# EAGLE schematic ARK (EAGLE 9.4.2)
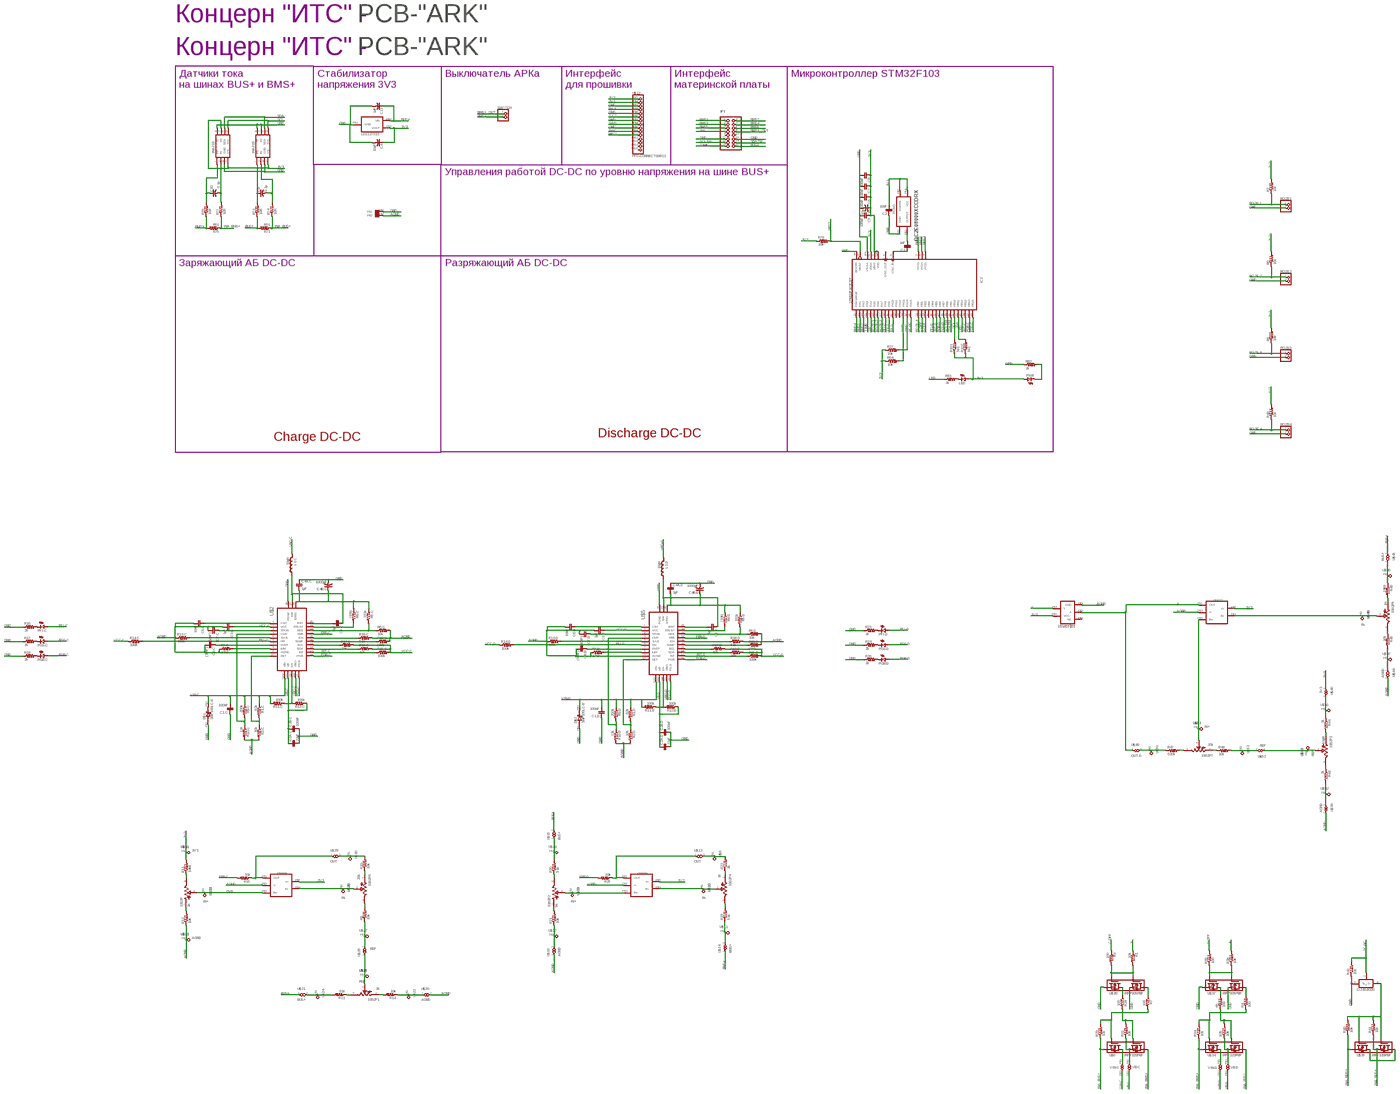
[diagram p0: schematic, sheet 1, overview]
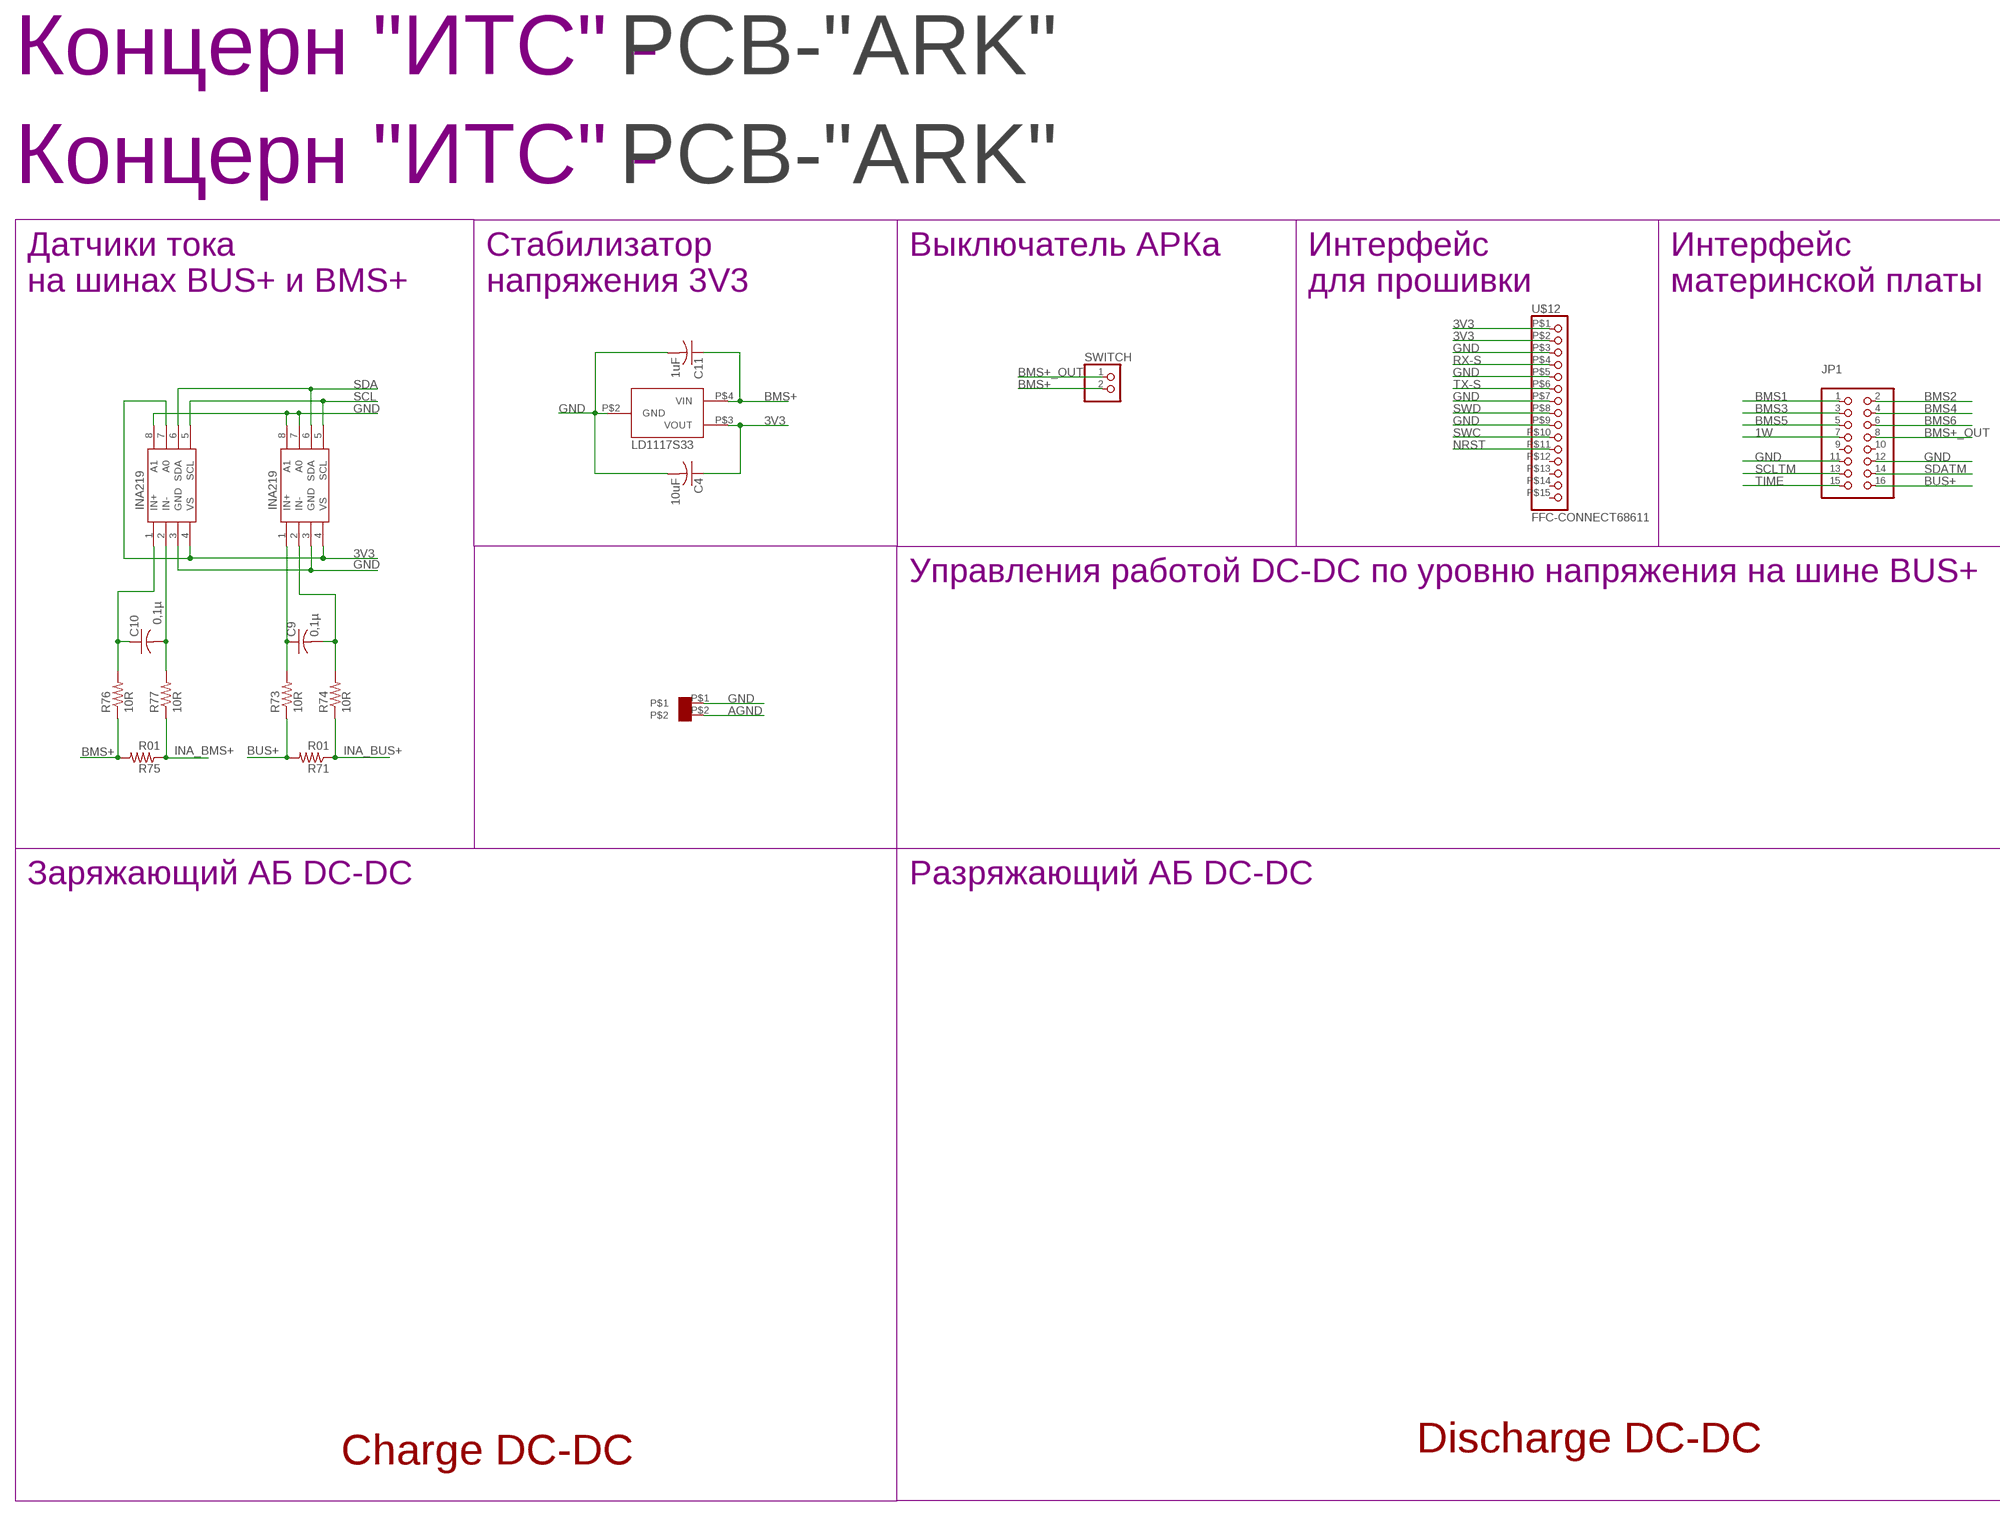
[diagram p1: schematic, sheet 1, part 1 of 4]
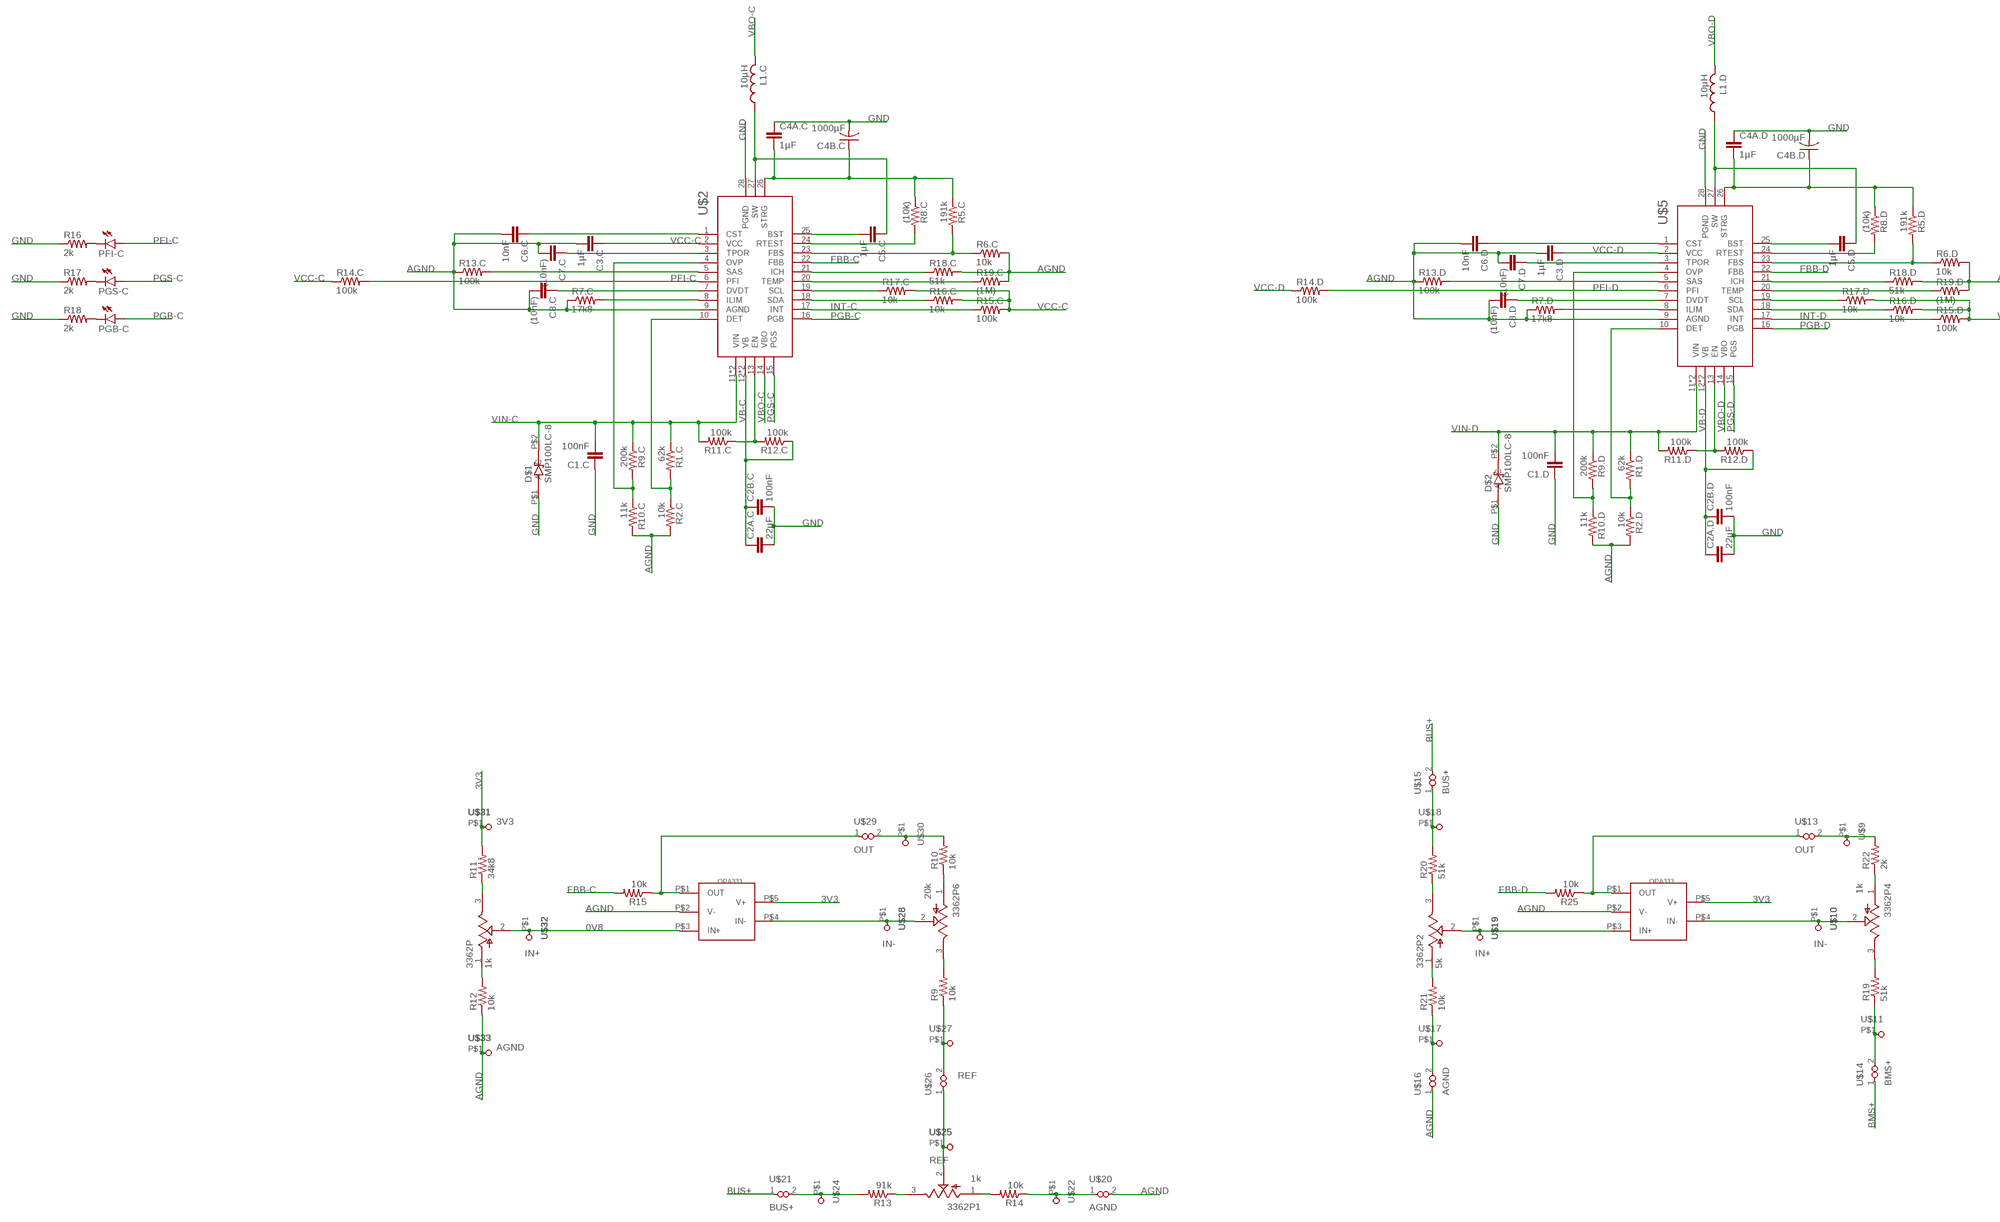
[diagram p2: schematic, sheet 1, part 2 of 4]
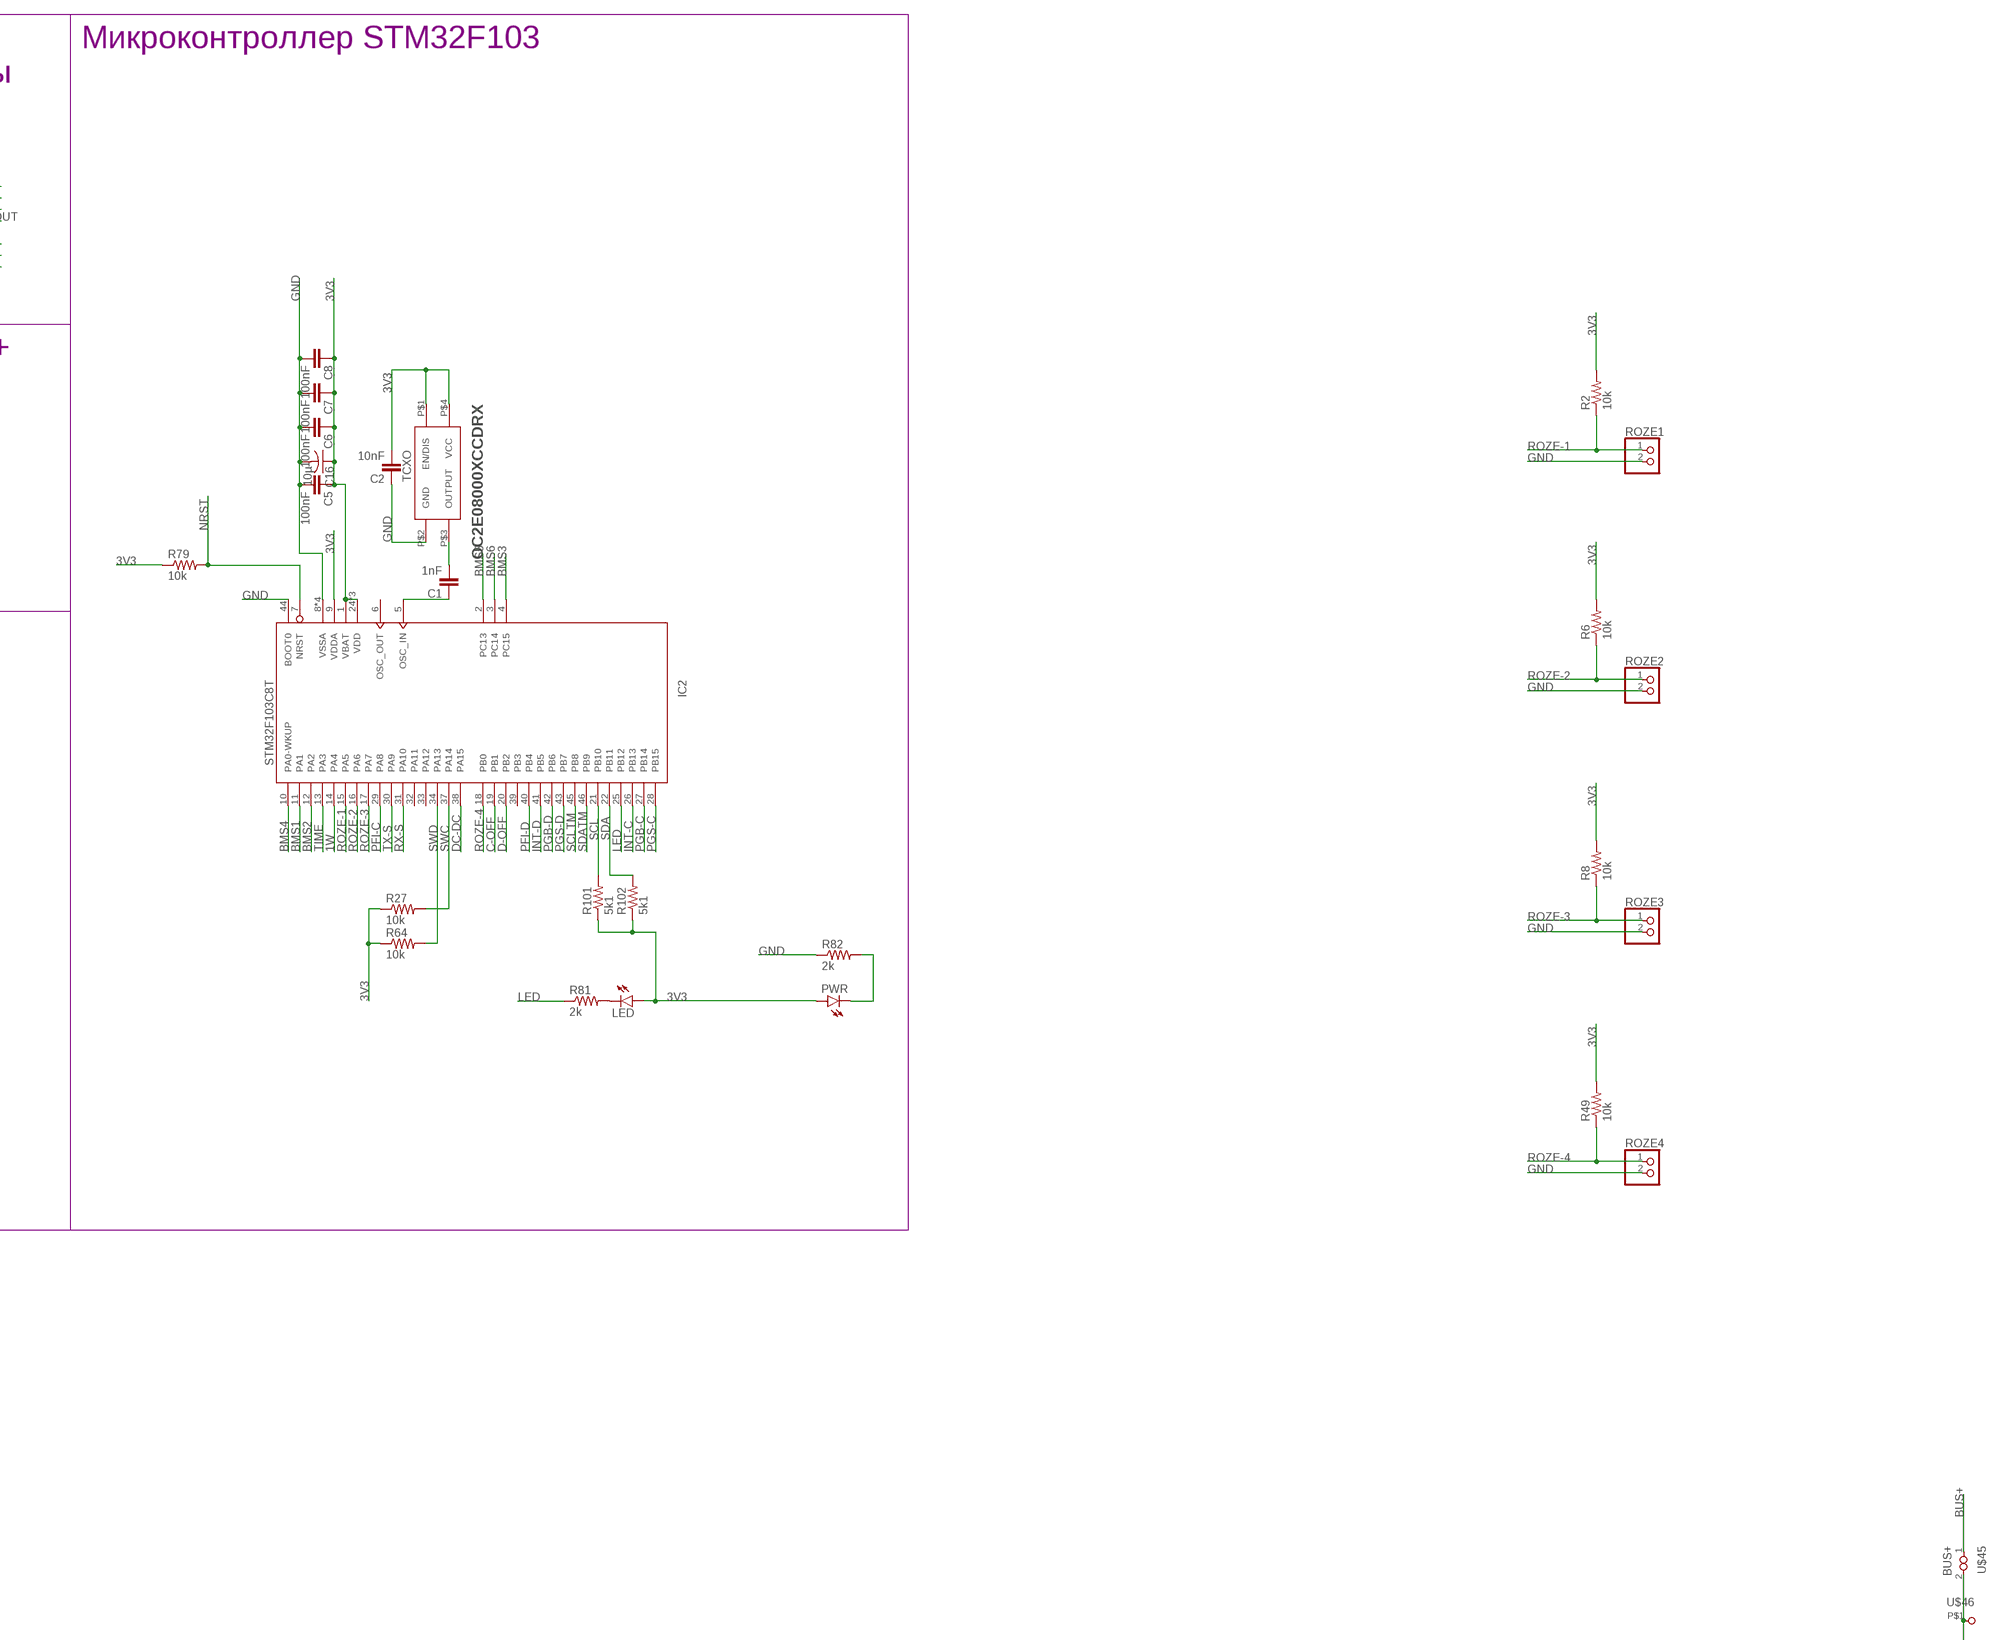
[diagram p3: schematic, sheet 1, part 3 of 4]
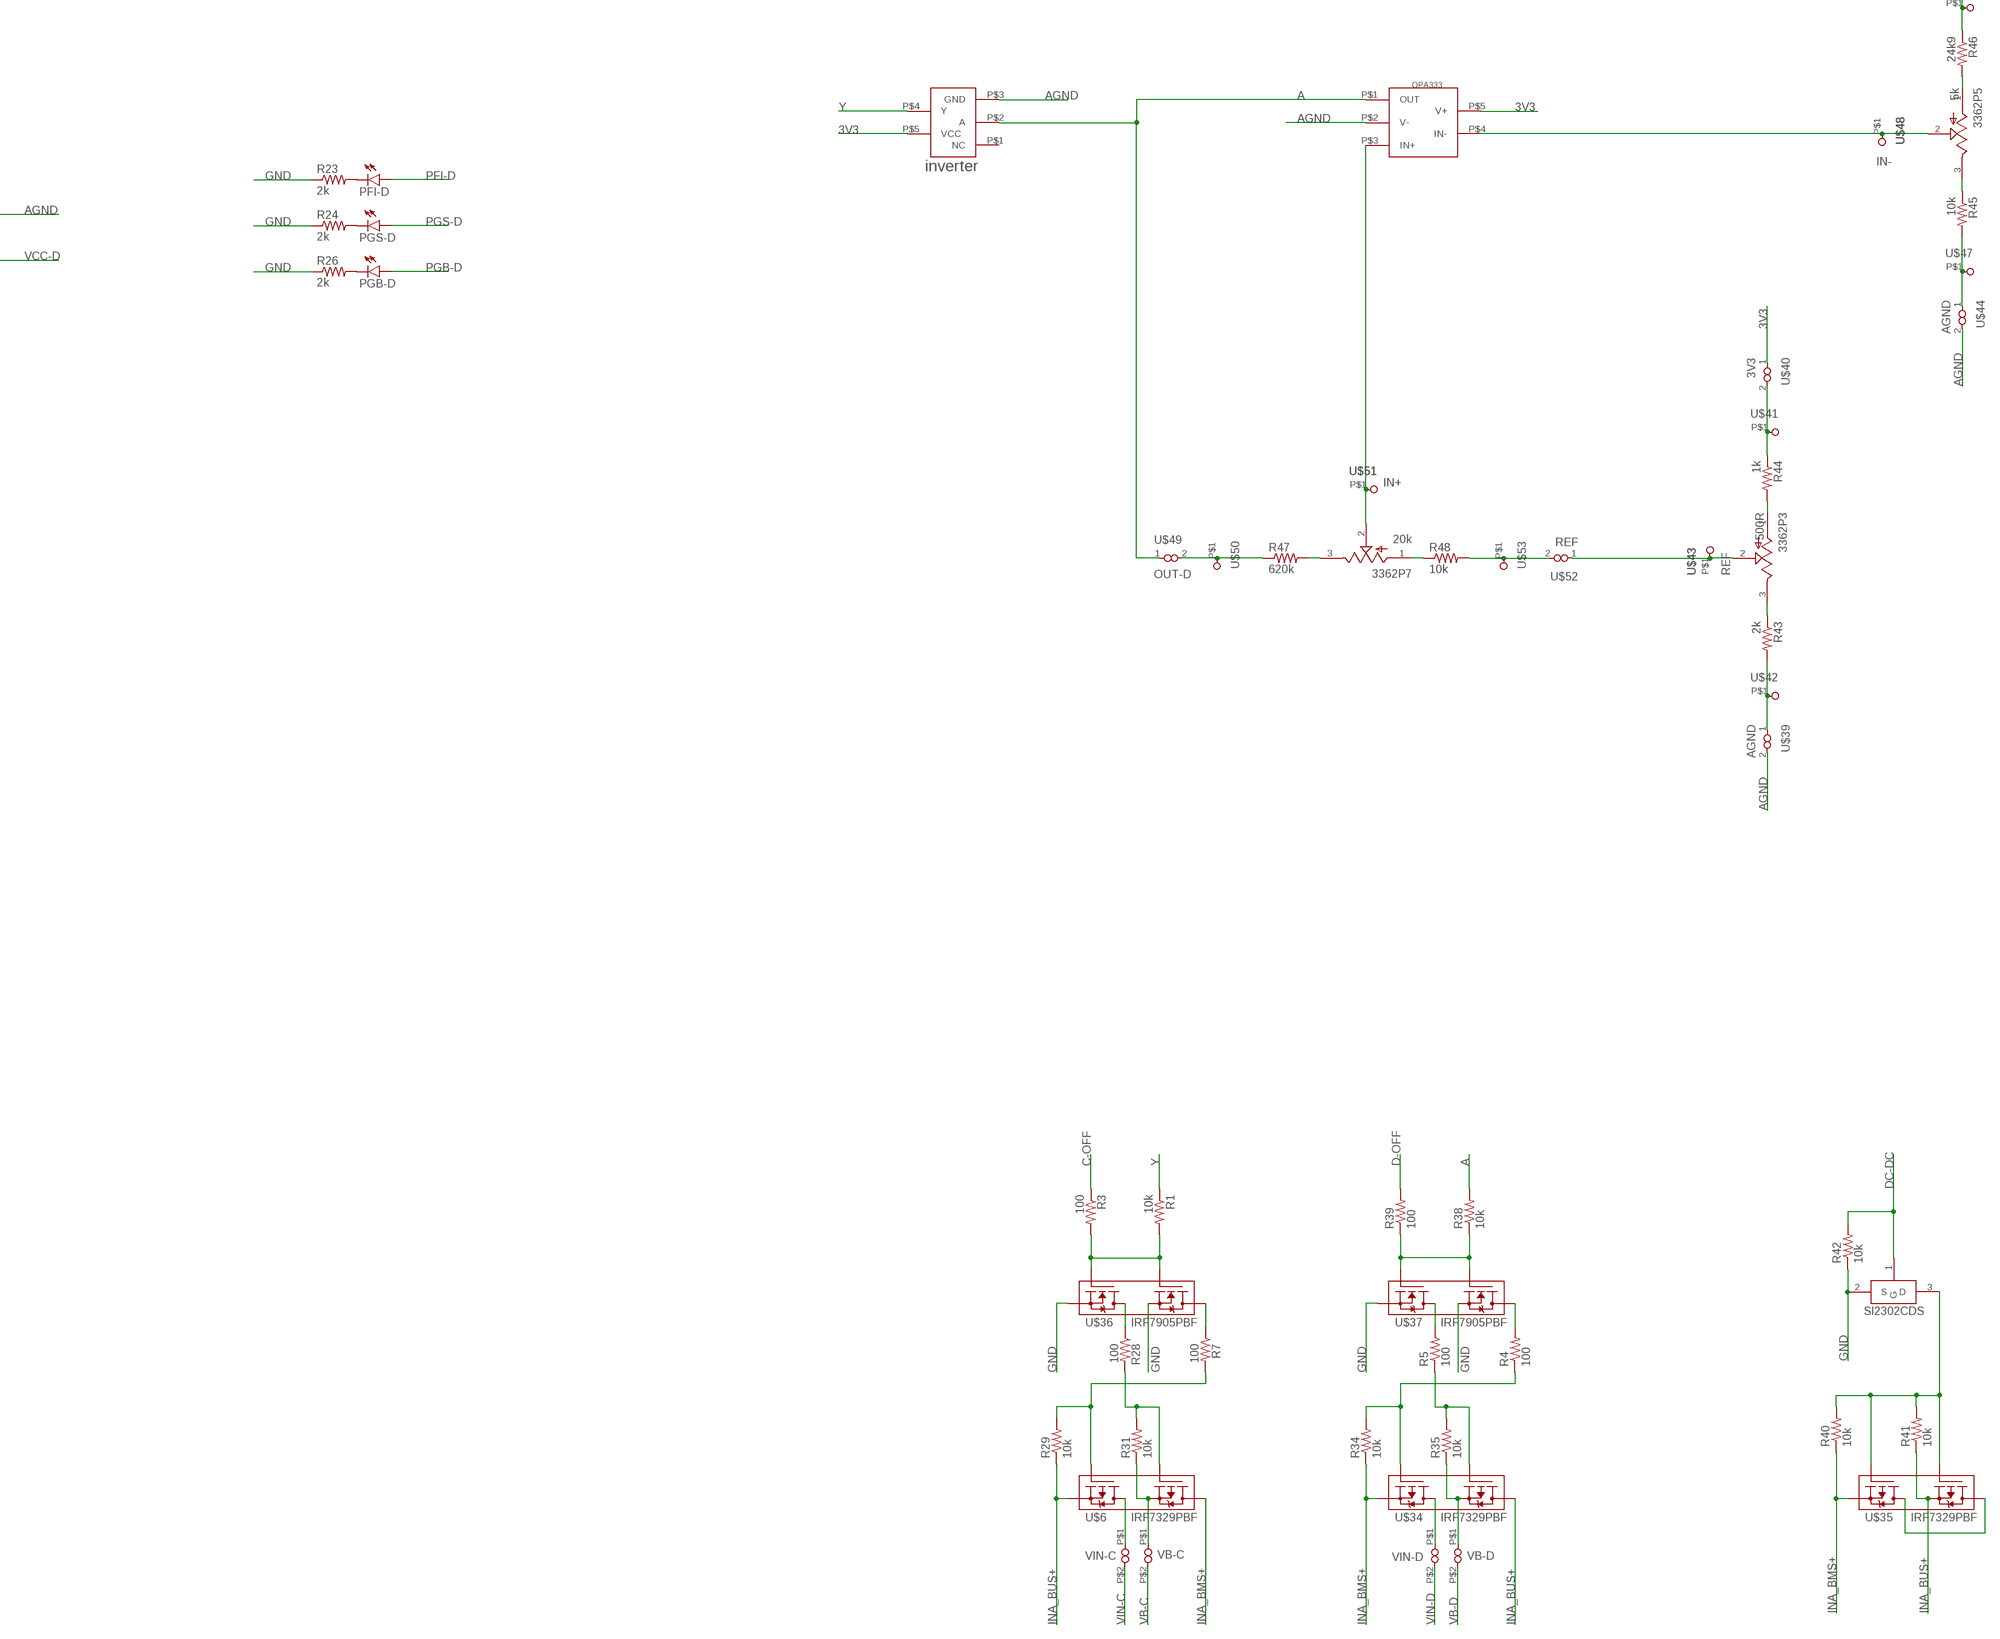
[diagram p4: schematic, sheet 1, part 4 of 4]

## Parts
3362P  1k  3362P-1-502LF  [TRIM_3362P-1-502LF]
3362P1  1k  3362P-1-502LF  [TRIM_3362P-1-502LF]
3362P2  5k  3362P-1-502LF  [TRIM_3362P-1-502LF]
3362P3  500R  3362P-1-502LF  [TRIM_3362P-1-502LF]
3362P4  1k  3362P-1-502LF  [TRIM_3362P-1-502LF]
3362P5  5k  3362P-1-502LF  [TRIM_3362P-1-502LF]
3362P6  20k  3362P-1-502LF  [TRIM_3362P-1-502LF]
3362P7  20k  3362P-1-502LF  [TRIM_3362P-1-502LF]
C1  1nF  C-EUC0603  [C0603]
C1.C  100nF  C-EUC0603  [C0603]
C1.D  100nF  C-EUC0603  [C0603]
C2  10nF  C-EUC0603  [C0603]
C2A.C  22µF  C-EUC1206  [C1206]
C2A.D  22µF  C-EUC1206  [C1206]
C2B.C  100nF  C-EUC0603  [C0603]
C2B.D  100nF  C-EUC0603  [C0603]
C3.C  1µF  C-EUC0603  [C0603]
C3.D  1µF  C-EUC0603  [C0603]
C4  10uF  ECAP1UF  [ECAP-SMD-D4]
C4A.C  1µF  C-EUC1206  [C1206]
C4A.D  1µF  C-EUC1206  [C1206]
C4B.C  1000µF  ECAPECAP1000  [ECAP1000-CMD]
C4B.D  1000µF  ECAPECAP1000  [ECAP1000-CMD]
C5  100nF  C-EUC0603  [C0603]
C5.C  1µF  C-EUC0603  [C0603]
C5.D  1µF  C-EUC0603  [C0603]
C6  100nF  C-EUC0603  [C0603]
C6.C  10nF  C-EUC0603  [C0603]
C6.D  10nF  C-EUC0603  [C0603]
C7  100nF  C-EUC0603  [C0603]
C7.C  (10nF)  C-EUC0603  [C0603]
C7.D  (10nF)  C-EUC0603  [C0603]
C8  100nF  C-EUC0603  [C0603]
C8.C  (10nF)  C-EUC0603  [C0603]
C8.D  (10nF)  C-EUC0603  [C0603]
C9  0,1µ  C-USC0603  [C0603]
C10  0,1µ  C-USC0603  [C0603]
C11  1uF  ECAP1UF  [ECAP-SMD-D4]
C16  10µ  C-USC1206  [C1206]
D$1  SMP100LC-8  [SMB]
D$2  SMP100LC-8  [SMB]
IC2  STM32F103C8T  [LQFP48]
INA219#1  INA219AID  [SOT23-8]
INA219#2  INA219AID  [SOT23-8]
INVERT1  INVERTER.  [SC70]
JP1  PINHD-2X8  [2X08]
L1.C  10µH  L_10MKH  [L_12X12]
L1.D  10µH  L_10MKH  [L_12X12]
LD1117S33  LD1117S33  [SOT223]
LED  LEDCHIPLED_0603  [CHIPLED_0603]
OPA1  OPA333  [SOT23-5]
OPA2  OPA333  [SOT23-5]
OPA3  OPA333  [SOT23-5]
PFI-C  LEDCHIPLED_0603  [CHIPLED_0603]
PFI-D  LEDCHIPLED_0603  [CHIPLED_0603]
PGB-C  LEDCHIPLED_0603  [CHIPLED_0603]
PGB-D  LEDCHIPLED_0603  [CHIPLED_0603]
PGS-C  LEDCHIPLED_0603  [CHIPLED_0603]
PGS-D  LEDCHIPLED_0603  [CHIPLED_0603]
PWR  LEDCHIPLED_0603  [CHIPLED_0603]
R1  10k  R-US_R0603  [R0603]
R1.C  62k  R-US_R0603  [R0603]
R1.D  62k  R-US_R0603  [R0603]
R2  10k  R-US_R0603  [R0603]
R2.C  10k  R-US_R0603  [R0603]
R2.D  10k  R-US_R0603  [R0603]
R3  100  R-US_R0603  [R0603]
R4  100  R-US_R0603  [R0603]
R5  100  R-US_R0603  [R0603]
R5.C  191k  R-US_R0603  [R0603]
R5.D  191k  R-US_R0603  [R0603]
R6  10k  R-US_R0603  [R0603]
R6.C  10k  R-US_R0603  [R0603]
R6.D  10k  R-US_R0603  [R0603]
R7  100  R-US_R0603  [R0603]
R7.C  17k8  R-US_R0603  [R0603]
R7.D  17k8  R-US_R0603  [R0603]
R8  10k  R-US_R0603  [R0603]
R8.C  (10k)  R-US_R0603  [R0603]
R8.D  (10k)  R-US_R0603  [R0603]
R9  10k  R-US_R0603  [R0603]
R9.C  200k  R-US_R0603  [R0603]
R9.D  200k  R-US_R0603  [R0603]
R10  10k  R-US_R0603  [R0603]
R10.C  11k  R-US_R0603  [R0603]
R10.D  11k  R-US_R0603  [R0603]
R11  34k8  R-US_R0603  [R0603]
R11.C  100k  R-US_R0603  [R0603]
R11.D  100k  R-US_R0603  [R0603]
R12  10k  R-US_R0603  [R0603]
R12.C  100k  R-US_R0603  [R0603]
R12.D  100k  R-US_R0603  [R0603]
R13  91k  R-US_R0603  [R0603]
R13.C  100k  R-US_R0603  [R0603]
R13.D  100k  R-US_R0603  [R0603]
R14  10k  R-US_R0603  [R0603]
R14.C  100k  R-US_R0603  [R0603]
R14.D  100k  R-US_R0603  [R0603]
R15  10k  R-US_R0603  [R0603]
R15.C  100k  R-US_R0603  [R0603]
R15.D  100k  R-US_R0603  [R0603]
R16  2k  R-US_R0603  [R0603]
R16.C  10k  R-US_R0603  [R0603]
R16.D  10k  R-US_R0603  [R0603]
R17  2k  R-US_R0603  [R0603]
R17.C  10k  R-US_R0603  [R0603]
R17.D  10k  R-US_R0603  [R0603]
R18  2k  R-US_R0603  [R0603]
R18.C  51k  R-US_R0603  [R0603]
R18.D  51k  R-US_R0603  [R0603]
R19  51k  R-US_R0603  [R0603]
R19.C  (1M)  R-US_R0603  [R0603]
R19.D  (1M)  R-US_R0603  [R0603]
R20  51k  R-US_R0603  [R0603]
R21  10k  R-US_R0603  [R0603]
R22  2k  R-US_R0603  [R0603]
R23  2k  R-US_R0603  [R0603]
R24  2k  R-US_R0603  [R0603]
R25  10k  R-US_R0603  [R0603]
R26  2k  R-US_R0603  [R0603]
R27  10k  R-US_R0603  [R0603]
R28  100  R-US_R0603  [R0603]
R29  10k  R-US_R0603  [R0603]
R31  10k  R-US_R0603  [R0603]
R34  10k  R-US_R0603  [R0603]
R35  10k  R-US_R0603  [R0603]
R38  10k  R-US_R0603  [R0603]
R39  100  R-US_R0603  [R0603]
R40  10k  R-US_R0603  [R0603]
R41  10k  R-US_R0603  [R0603]
R42  10k  R-US_R0603  [R0603]
R43  2k  R-US_R0603  [R0603]
R44  1k  R-US_R0603  [R0603]
R45  10k  R-US_R0603  [R0603]
R46  24k9  R-US_R0603  [R0603]
R47  620k  R-US_R0603  [R0603]
R48  10k  R-US_R0603  [R0603]
R49  10k  R-US_R0603  [R0603]
R64  10k  R-US_R0603  [R0603]
R71  R01  R-US_R2512  [R2512]
R73  10R  R-US_R0603  [R0603]
R74  10R  R-US_R0603  [R0603]
R75  R01  R-US_R2512  [R2512]
R76  10R  R-US_R0603  [R0603]
R77  10R  R-US_R0603  [R0603]
R79  10k  R-US_R0603  [R0603]
R81  2k  R-US_R0603  [R0603]
R82  2k  R-US_R0603  [R0603]
R101  5k1  R-US_R0603  [R0603]
R102  5k1  R-US_R0603  [R0603]
ROZE1  PINHD-1X2  [1X02]
ROZE2  PINHD-1X2  [1X02]
ROZE3  PINHD-1X2  [1X02]
ROZE4  PINHD-1X2  [1X02]
SWITCH  PINHD-1X2  [1X02]
TCXO  OC2E08000XCCDRX  [OC2E08000XCCDRX]
U$1  VIN-C  VIAS-CONNECTW1.4MM  [SOLDERING-PAD-4A]
U$2  MP5515  [QFN-30]
U$3  PCB-"ARK"  ITS-LOGOPCB-""  [ITS-LOGO]
U$4  PCB-"ARK"  ITS-LOGOPCB-""  [ITS-LOGO]
U$5  MP5515  [QFN-30]
U$6  IRF7329PBF  [SO8]
U$7  GNDS-CONNECTOR  [GNDS-CONNECTOR]
U$9  VIAS  [VIAS]
U$10  IN-  VIAS  [VIAS]
U$11  VIAS  [VIAS]
U$12  FFC-CONNECT68611  [68611]
U$13  OUT  VIAS-CONNECT  [VIAS-CONNECT]
U$14  BMS+  VIAS-CONNECT  [VIAS-CONNECT]
U$15  BUS+  VIAS-CONNECT  [VIAS-CONNECT]
U$16  AGND  VIAS-CONNECT  [VIAS-CONNECT]
U$17  VIAS  [VIAS]
U$18  VIAS  [VIAS]
U$19  IN+  VIAS  [VIAS]
U$20  AGND  VIAS-CONNECT  [VIAS-CONNECT]
U$21  BUS+  VIAS-CONNECT  [VIAS-CONNECT]
U$22  VIAS  [VIAS]
U$23  VB-C  VIAS-CONNECTW1.4MM  [SOLDERING-PAD-4A]
U$24  VIAS  [VIAS]
U$25  REF  VIAS  [VIAS]
U$26  REF  VIAS-CONNECT  [VIAS-CONNECT]
U$27  VIAS  [VIAS]
U$28  IN-  VIAS  [VIAS]
U$29  OUT  VIAS-CONNECT  [VIAS-CONNECT]
U$30  VIAS  [VIAS]
U$31  3V3  VIAS  [VIAS]
U$32  IN+  VIAS  [VIAS]
U$33  AGND  VIAS  [VIAS]
U$34  IRF7329PBF  [SO8]
U$35  IRF7329PBF  [SO8]
U$36  IRF7905PBF  [SO8]
U$37  IRF7905PBF  [SO8]
U$38  SI2302CDS  [SOT23-3]
U$39  AGND  VIAS-CONNECT  [VIAS-CONNECT]
U$40  3V3  VIAS-CONNECT  [VIAS-CONNECT]
U$41  VIAS  [VIAS]
U$42  VIAS  [VIAS]
U$43  REF  VIAS  [VIAS]
U$44  AGND  VIAS-CONNECT  [VIAS-CONNECT]
U$45  BUS+  VIAS-CONNECT  [VIAS-CONNECT]
U$46  VIAS  [VIAS]
U$47  VIAS  [VIAS]
U$48  IN-  VIAS  [VIAS]
U$49  OUT-D  VIAS-CONNECT  [VIAS-CONNECT]
U$50  VIAS  [VIAS]
U$51  IN+  VIAS  [VIAS]
U$52  REF  VIAS-CONNECT  [VIAS-CONNECT]
U$53  VIAS  [VIAS]
U$54  VIN-D  VIAS-CONNECTW1.4MM  [SOLDERING-PAD-4A]
U$55  VB-D  VIAS-CONNECTW1.4MM  [SOLDERING-PAD-4A]

## Nets
0V8: 3362P.2(WIPER) OPA2.P$3(IN+) U$32.P$1
1W: IC2.14(PA4) JP1.7
3V3: C2.2 C4.P+ C5.1 C6.1 C7.1 C8.1 C16.1 IC2.1(VBAT) IC2.9(VDDA) IC2.24(VDD) IC2.36(VDD) IC2.48(VDD) INA219#1.4(VS) INA219#2.4(VS) INA219#2.7(A0) INVERT1.P$5(VCC) LD1117S33.P$3(VOUT) LED.A OPA1.P$5(V+) OPA2.P$5(V+) OPA3.P$5(V+) PWR.A R2.2 R6.2 R8.2 R11.2 R27.1 R49.2 R64.1 R79.1 R101.1 R102.1 TCXO.P$1(EN/DIS) TCXO.P$4(VCC) U$12.P$1 U$12.P$2 U$31.P$1 U$40.1
A: INVERT1.P$2(A) OPA1.P$1(OUT) R38.2 U$49.1
AGND: C3.C.2 C3.D.2 C6.C.2 C6.D.2 C7.C.2 C7.D.2 C8.C.2 C8.D.2 INVERT1.P$3(GND) OPA1.P$2(V-) OPA2.P$2(V-) OPA3.P$2(V-) R2.C.2 R2.D.2 R6.C.2 R6.D.2 R7.C.1 R7.D.1 R10.C.2 R10.D.2 R12.1 R13.C.1 R13.D.1 R18.C.2 R18.D.2 R19.C.2 R19.D.2 U$2.9(AGND) U$5.9(AGND) U$7.P$2 U$16.1 U$20.2 U$33.P$1 U$39.2 U$44.2
BMS1: IC2.11(PA1) JP1.1
BMS2: IC2.12(PA2) JP1.2
BMS3: IC2.4(PC15) JP1.3
BMS4: IC2.10(PA0-WKUP) JP1.4
BMS5: IC2.2(PC13) JP1.5
BMS6: IC2.3(PC14) JP1.6
BMS+: C11.P+ LD1117S33.P$4(VIN) R75.2 R76.1 SWITCH.2 U$14.1
BMS+_OUT: JP1.8 SWITCH.1
BUS+: JP1.16 R71.2 R73.1 U$15.2 U$21.1 U$45.1
C-OFF: IC2.19(PB1) R3.1
D-OFF: IC2.20(PB2) R39.2
DC-DC: IC2.38(PA15) R42.2 U$38.1(G)
FBB-C: R15.2 U$2.22(FBB)
FBB-D: R25.2 U$5.22(FBB)
GND: C1.C.1 C1.D.1 C2.1 C2A.C.2 C2A.D.2 C2B.C.2 C2B.D.2 C4.P- C4A.C.1 C4A.D.1 C4B.C.P$2 C4B.D.P$2 C5.2 C6.2 C7.2 C8.2 C11.P- C16.2 D$1.P$1(A) D$2.P$1(A) IC2.8(VSSA) IC2.23(VSSA) IC2.35(VSSA) IC2.44(BOOT0) IC2.47(VSSA) INA219#1.3(GND) INA219#1.7(A0) INA219#1.8(A1) INA219#2.3(GND) INA219#2.8(A1) JP1.11 JP1.12 LD1117S33.P$2(GND) R16.1 R17.1 R18.1 R23.1 R24.1 R26.1 R42.1 R82.1 ROZE1.2 ROZE2.2 ROZE3.2 ROZE4.2 TCXO.P$2(GND) U$2.28(PGND) U$5.28(PGND) U$7.P$1 U$12.P$3 U$12.P$5 U$12.P$7 U$12.P$9 U$36.1(S2) U$36.3(S1) U$37.1(S2) U$37.3(S1) U$38.2(S)
INA_BMS+: R34.1 R40.1 R75.1 R77.1 U$6.7(D1) U$6.8(D1) U$34.3(S2) U$35.3(S2)
INA_BUS+: R29.1 R41.1 R71.1 R74.1 U$6.3(S2) U$34.7(D1) U$34.8(D1) U$35.1(S1)
INT-C: IC2.26(PB13) R15.C.1 U$2.17(INT)
INT-D: IC2.41(PB5) R15.D.1 U$5.17(INT)
LED: IC2.25(PB12) R81.1
N$1: C1.1 IC2.5(OSC_IN)
N$2: U$1.P$1 U$6.5(D2) U$6.6(D2)
N$3: R31.1 U$6.1(S1) U$23.P$1
N$4: C1.2 TCXO.P$3(OUTPUT)
N$5: R4.1 R34.2 U$34.4(G2)
N$6: OPA3.P$1(OUT) R25.1 U$13.1
N$7: R11.C.1 R12.C.2 U$2.13(EN)
N$8: R7.C.2 U$2.8(ILIM)
N$9: C7.C.1 U$2.3(TPOR)
N$10: R1.C.2 R2.C.1 U$2.10(DET)
N$11: R9.C.2 R10.C.1 U$2.4(OVP)
N$12: C8.C.1 U$2.7(DVDT)
N$13: R18.C.1 U$2.21(ICH)
N$14: C9.2 INA219#1.2(IN-) R74.2
N$15: R19.C.1 U$2.20(TEMP)
N$16: R13.C.2 U$2.5(SAS)
N$17: LED.C R81.2
N$18: C6.C.1 U$2.1(CST)
N$19: C4A.C.2 C4B.C.P$1 R5.C.1 R8.C.1 U$2.26(STRG)
N$20: C5.C.2 U$2.25(BST)
N$21: C5.C.1 L1.C.P$1 U$2.27(SW)
N$22: R5.C.2 R6.C.1 U$2.23(FBS)
N$23: R8.C.2 U$2.24(RTEST)
N$24: 3362P4.1(CCW) R22.1
N$25: R7.2 R29.2 U$6.4(G2)
N$26: R17.C.1 U$2.19(SCL)
N$27: R16.C.1 U$2.18(SDA)
N$28: R5.1 R35.2 U$34.2(G1)
N$29: 3362P2.2(WIPER) OPA3.P$3(IN+) U$19.P$1
N$30: R11.D.1 R12.D.2 U$5.13(EN)
N$31: R1.D.2 R2.D.1 U$5.10(DET)
N$32: R9.D.2 R10.D.1 U$5.4(OVP)
N$33: R7.D.2 U$5.8(ILIM)
N$34: C7.D.1 U$5.3(TPOR)
N$35: C8.D.1 U$5.7(DVDT)
N$36: R18.D.1 U$5.21(ICH)
N$37: R19.D.1 U$5.20(TEMP)
N$38: R13.D.2 U$5.5(SAS)
N$39: C6.D.1 U$5.1(CST)
N$40: C5.D.2 U$5.25(BST)
N$41: C5.D.1 L1.D.P$1 U$5.27(SW)
N$42: R5.D.2 R6.D.1 U$5.23(FBS)
N$43: R8.D.2 U$5.24(RTEST)
N$44: C4A.D.2 C4B.D.P$1 R5.D.1 R8.D.1 U$5.26(STRG)
N$46: U$35.5(D2) U$35.6(D2) U$35.7(D1) U$35.8(D1)
N$47: R17.D.1 U$5.19(SCL)
N$48: R1.2 R3.2 U$36.2(G2) U$36.4(G1)
N$49: R16.D.1 U$5.18(SDA)
N$50: U$34.5(D2) U$34.6(D2) U$54.P$1
N$51: R38.1 R39.1 U$37.2(G2) U$37.4(G1)
N$52: OPA2.P$1(OUT) R15.1 U$29.1
N$53: 3362P6.2(WIPER) OPA2.P$4(IN-) U$28.P$1
N$54: 3362P6.3(CW) R9.2
N$55: 3362P6.1(CCW) R10.1
N$56: PFI-C.C R16.2
N$57: 3362P.3(CW) R11.1
N$58: 3362P.1(CCW) R12.2
N$59: 3362P1.3(CW) R13.1
N$60: 3362P1.1(CCW) R14.2
N$61: 3362P1.2(WIPER) U$25.P$1 U$26.1
N$62: 3362P2.3(CW) R20.1
N$63: PGS-C.C R17.2
N$64: 3362P2.1(CCW) R21.2
N$65: PGB-C.C R18.2
N$66: 3362P4.2(WIPER) OPA3.P$4(IN-) U$10.P$1
N$67: 3362P4.3(CW) R19.2
N$68: PFI-D.C R23.2
N$69: PGS-D.C R24.2
N$70: PGB-D.C R26.2
N$71: R22.2 U$9.P$1 U$13.2
N$72: R19.1 U$11.P$1 U$14.2
N$73: R20.2 U$15.1 U$18.P$1
N$74: R21.1 U$16.2 U$17.P$1
N$75: R13.2 U$21.2 U$24.P$1
N$76: R14.1 U$20.1 U$22.P$1
N$77: R35.1 U$34.1(S1) U$55.P$1
N$78: R5.2 U$37.7(D2) U$37.8(D2)
N$79: R28.1 U$36.7(D2) U$36.8(D2)
N$80: R4.2 U$37.5(D1) U$37.6(D1)
N$81: R7.1 U$36.5(D1) U$36.6(D1)
N$83: R9.1 U$26.2 U$27.P$1
N$86: R10.2 U$29.2 U$30.P$1
N$88: R28.2 R31.2 U$6.2(G1)
N$90: 3362P3.3(CW) R43.1
N$93: 3362P3.1(CCW) R44.2
N$94: 3362P3.2(WIPER) U$43.P$1 U$52.1
N$95: R40.2 R41.2 U$35.2(G1) U$35.4(G2) U$38.3(D)
N$96: R43.2 U$39.1 U$42.P$1
N$97: R44.1 U$40.2 U$41.P$1
N$98: 3362P5.3(CW) R45.1
N$99: 3362P5.1(CCW) R46.2
N$100: 3362P5.2(WIPER) OPA1.P$4(IN-) U$48.P$1
N$101: R45.2 U$44.1 U$47.P$1
N$102: R46.1 U$45.2 U$46.P$1
N$104: 3362P7.1(CCW) R48.1
N$105: 3362P7.2(WIPER) OPA1.P$3(IN+) U$51.P$1
N$106: 3362P7.3(CW) R47.2
N$108: R47.1 U$49.2 U$50.P$1
N$109: R48.2 U$52.2 U$53.P$1
N$147: C9.1 INA219#1.1(IN+) R73.2
N$150: C10.1 INA219#2.1(IN+) R76.2
N$151: C10.2 INA219#2.2(IN-) R77.2
N$159: PWR.C R82.2
NRST: IC2.7(NRST) R79.2 U$12.P$11
PFI-C: IC2.29(PA8) PFI-C.A R14.C.2 U$2.6(PFI)
PFI-D: IC2.40(PB4) PFI-D.A R14.D.2 U$5.6(PFI)
PGB-C: IC2.27(PB14) PGB-C.A U$2.16(PGB)
PGB-D: IC2.42(PB6) PGB-D.A U$5.16(PGB)
PGS-C: IC2.28(PB15) PGS-C.A U$2.15(PGS)
PGS-D: IC2.43(PB7) PGS-D.A U$5.15(PGS)
ROZE-1: IC2.15(PA5) R2.1 ROZE1.1
ROZE-2: IC2.16(PA6) R6.1 ROZE2.1
ROZE-3: IC2.17(PA7) R8.1 ROZE3.1
ROZE-4: IC2.18(PB0) R49.1 ROZE4.1
RX-S: IC2.31(PA10) U$12.P$4
SCL: IC2.21(PB10) INA219#1.5(SCL) INA219#2.5(SCL) R101.2
SCLTM: IC2.45(PB8) JP1.13
SDA: IC2.22(PB11) INA219#1.6(SDA) INA219#2.6(SDA) R102.2
SDATM: IC2.46(PB9) JP1.14
SWC: IC2.37(PA14) R27.2 U$12.P$10
SWD: IC2.34(PA13) R64.2 U$12.P$8
TIME: IC2.13(PA3) JP1.15
TX-S: IC2.30(PA9) U$12.P$6
VB-C: C2A.C.1 C2B.C.1 R12.C.1 U$2.12(VB) U$2.29(VB) U$23.P$2
VB-D: C2A.D.1 C2B.D.1 R12.D.1 U$5.12(VB) U$5.29(VB) U$55.P$2
VBO-C: L1.C.P$2 U$2.14(VBO)
VBO-D: L1.D.P$2 U$5.14(VBO)
VCC-C: C3.C.1 R14.C.1 R15.C.2 R16.C.2 R17.C.2 U$2.2(VCC)
VCC-D: C3.D.1 R14.D.1 R15.D.2 R16.D.2 R17.D.2 U$5.2(VCC)
VIN-C: C1.C.2 D$1.P$2(C) R1.C.1 R9.C.1 R11.C.2 U$1.P$2 U$2.11(VIN) U$2.30(VIN)
VIN-D: C1.D.2 D$2.P$2(C) R1.D.1 R9.D.1 R11.D.2 U$5.11(VIN) U$5.30(VIN) U$54.P$2
Y: INVERT1.P$4(Y) R1.1
Unconnected: IC2.6(OSC_OUT) IC2.32(PA11) IC2.33(PA12) IC2.39(PB3) INVERT1.P$1(NC) JP1.9 JP1.10 U$12.P$12 U$12.P$13 U$12.P$14 U$12.P$15

## Notes on the sheet
- Датчики тока
  на шинах BUS+ и BMS+
- Стабилизатор
  напряжения 3V3
- Выключатель АРКа
- Интерфейс
  для прошивки
- Интерфейс
  материнской платы
- Микроконтроллер STM32F103
- Управления работой DC-DC по уровню напряжения на шине BUS+
- Заряжающий АБ DC-DC | Разряжающий АБ DC-DC
- Charge DC-DC | Discharge DC-DC

## Library data of the parts
3362P 3362P1-3362P7 = CanCubeSat:3362P-1-502LF: Res Cermet Trimmer 50K Ohm 10% 1/2W 1(Elec)/1(Mech)Turn 2.77mm (6.6 X 6.99 X 4.7mm) Pin Thru-Hole Tube Check prices <https://pricing.snapeda.com/parts/3362P-1-502LF/Bourns/view-part?ref=eda>; AVAILABILITY: Good; DESCRIPTION: 5 kOhms 0.5W, 1/2W PC Pins Through Hole Trimmer Potentiometer Cermet 1 Turn Top Adjustment; MF: Bourns; MP: 3362P-1-502LF; PACKAGE: 3362P-1 Bourns Inc.; PRICE: None; PURCHASE-URL: https://pricing.snapeda.com/search/part/3362P-1-502LF/?ref=eda
C1 C1.C C1.D C2 C2A.C C2A.D C2B.C C2B.D C3.C C3.D C4A.C C4A.D C5 C5.C C5.D C6 C6.C C6.D C7 C7.C C7.D C8 C8.C C8.D = rcl:C-EU: CAPACITOR, European symbol; SPICEPREFIX: C
C4 C4B.C C4B.D C11 = CanCubeSat:ECAP
C9 C10 C16 = rcl:C-US: CAPACITOR, American symbol; SPICEPREFIX: C
D$1 D$2 = CanCubeSat:SMP100LC-8
IC2 = CanCubeSat:STM32F103C*T: ARM 32-bit Cortex™-M3 CPU 72 MHz maximum frequency 16 to 128 Kbytes of Flash memory 6 to 20 kbytes of SRAM 37 GPIOs 2.0 to 3.6 V application supply
INA219#1 INA219#2 = CanCubeSat:INA219AID
INVERT1 = CanCubeSat:INVERTER
JP1 = pinheadCS:PINHD-2X8: PIN HEADER
L1.C L1.D = CanCubeSat:L_10MKH
LD1117S33 = CanCubeSat:LD1117S33
LED PFI-C PFI-D PGB-C PGB-D PGS-C PGS-D PWR = led:LED: LED OSRAM: - CHIPLED LG R971, LG N971, LY N971, LG Q971, LY Q971, LO R971, LY R971 LH N974, LH R974 LS Q976, LO Q976, LY Q976 LO Q996 - Hyper CHIPLED LW Q18S LB Q993, LB Q99A, LB R99A - SideLED LS A670, LO A670, LY A670, LG A670, LP A670 LB A673, LV A673, LT A673, LW A673 LH A674 LY A675 LS A676, LA A676, LO A676, LY A676, LW A676 LS A679, LY A679, LG A679 - Hyper Micro SIDELED® LS Y876, LA Y876, LO Y876, LY Y876 LT Y87S - SmartLED LW L88C, LW L88S LB L89C, LB L89S, LG L890 LS L89K, LO L89K, LY L89K LS L896, LA L896, LO L896, LY L896 - TOPLED LS T670, LO T670, LY T670, LG T670, LP T670 LSG T670, LSP T670, LSY T670, LOP T670, LYG T670 LG T671, LOG T671, LSG T671 LB T673, LV T673, LT T673, LW T673 LH T674 LS T676, LA T676, LO T676, LY T676, LB T676, LH T676, LSB T676, LW T676 LB T67C, LV T67C, LT T67C, LS T67K, LO T67K, LY T67K, LW E67C LS E67B, LA E67B, LO E67B, LY E67B, LB E67C, LV E67C, LT E67C LW T67C LS T679, LY T679, LG T679 LS T770, LO T770, LY T770, LG T770, LP T770 LB T773, LV T773, LT T773, LW T773 LH T774 LS E675, LA E675, LY E675, LS T675 LS T776, LA T776, LO T776, LY T776, LB T776 LHGB T686 LT T68C, LB T68C - Hyper Mini TOPLED® LB M676 - Mini TOPLED Santana® LG M470 LS M47K, LO M47K, LY M47K Source: http://www.osram.convergy.de LUXEON: - LUMILED® LXK2-PW12-R00, LXK2-PW12-S00, LXK2-PW14-U00, LXK2-PW14-V00 LXK2-PM12-R00, LXK2-PM12-S00, LXK2-PM14-U00 LXK2-PE12-Q00, LXK2-PE12-R00, LXK2-PE12-S00, LXK2-PE14-T00, LXK2-PE14-U00 LXK2-PB12-K00, LXK2-PB12-L00, LXK2-PB12-M00, LXK2-PB14-N00, LXK2-PB14-P00, LXK2-PB14-Q00 LXK2-PR12-L00, LXK2-PR12-M00, LXK2-PR14-Q00, LXK2-PR14-R00 LXK2-PD12-Q00, LXK2-PD12-R00, LXK2-PD12-S00 LXK2-PH12-R00, LXK2-PH12-S00 LXK2-PL12-P00, LXK2-PL12-Q00, LXK2-PL12-R00 Source: www.luxeon.com KINGBRIGHT: KA-3528ASYC Source: www.kingbright.com
OPA1-OPA3 = CanCubeSat:OPA333
R1-R29 R31 R34 R35 R38-R49 R64 R73 R74 R76 R77 R79 R81 R82 R101 R102 = resistor:R-US_: RESISTOR, American symbol
R1.C R1.D R2.C R2.D R5.C R5.D R6.C R6.D R7.C R7.D R8.C R8.D R9.C R9.D R10.C R10.D R11.C R11.D R12.C R12.D R13.C R13.D R14.C R14.D R15.C R15.D R16.C R16.D R17.C R17.D R18.C R18.D R19.C R19.D R71 R75 = rcl:R-US_: RESISTOR, American symbol; SPICEPREFIX: R
ROZE1-ROZE4 SWITCH = pinheadCS:PINHD-1X2: PIN HEADER
TCXO = CanCubeSat:OC2E08000XCCDRX: TCXO OC2E08000XCCDRX 8 MHz
U$1 U$13-U$16 U$20 U$21 U$23 U$26 U$29 U$39 U$40 U$44 U$45 U$49 U$52 U$54 U$55 = CanCubeSat:VIAS-CONNECT
U$2 U$5 = CanCubeSat:MP5515
U$3 U$4 = CanCubeSat:ITS-LOGO
U$6 U$34 U$35 = CanCubeSat:IRF7329PBF
U$7 = CanCubeSat:GNDS-CONNECTOR
U$9-U$11 U$17-U$19 U$22 U$24 U$25 U$27 U$28 U$30-U$33 U$41-U$43 U$46-U$48 U$50 U$51 U$53 = CanCubeSat:VIAS
U$12 = CanCubeSat:FFC-CONNECT
U$36 U$37 = CanCubeSat:IRF7905PBF
U$38 = CanCubeSat:SI2302CDS